# EAGLE design lithium_battery_manager_v12 (EAGLE 9.0.1)
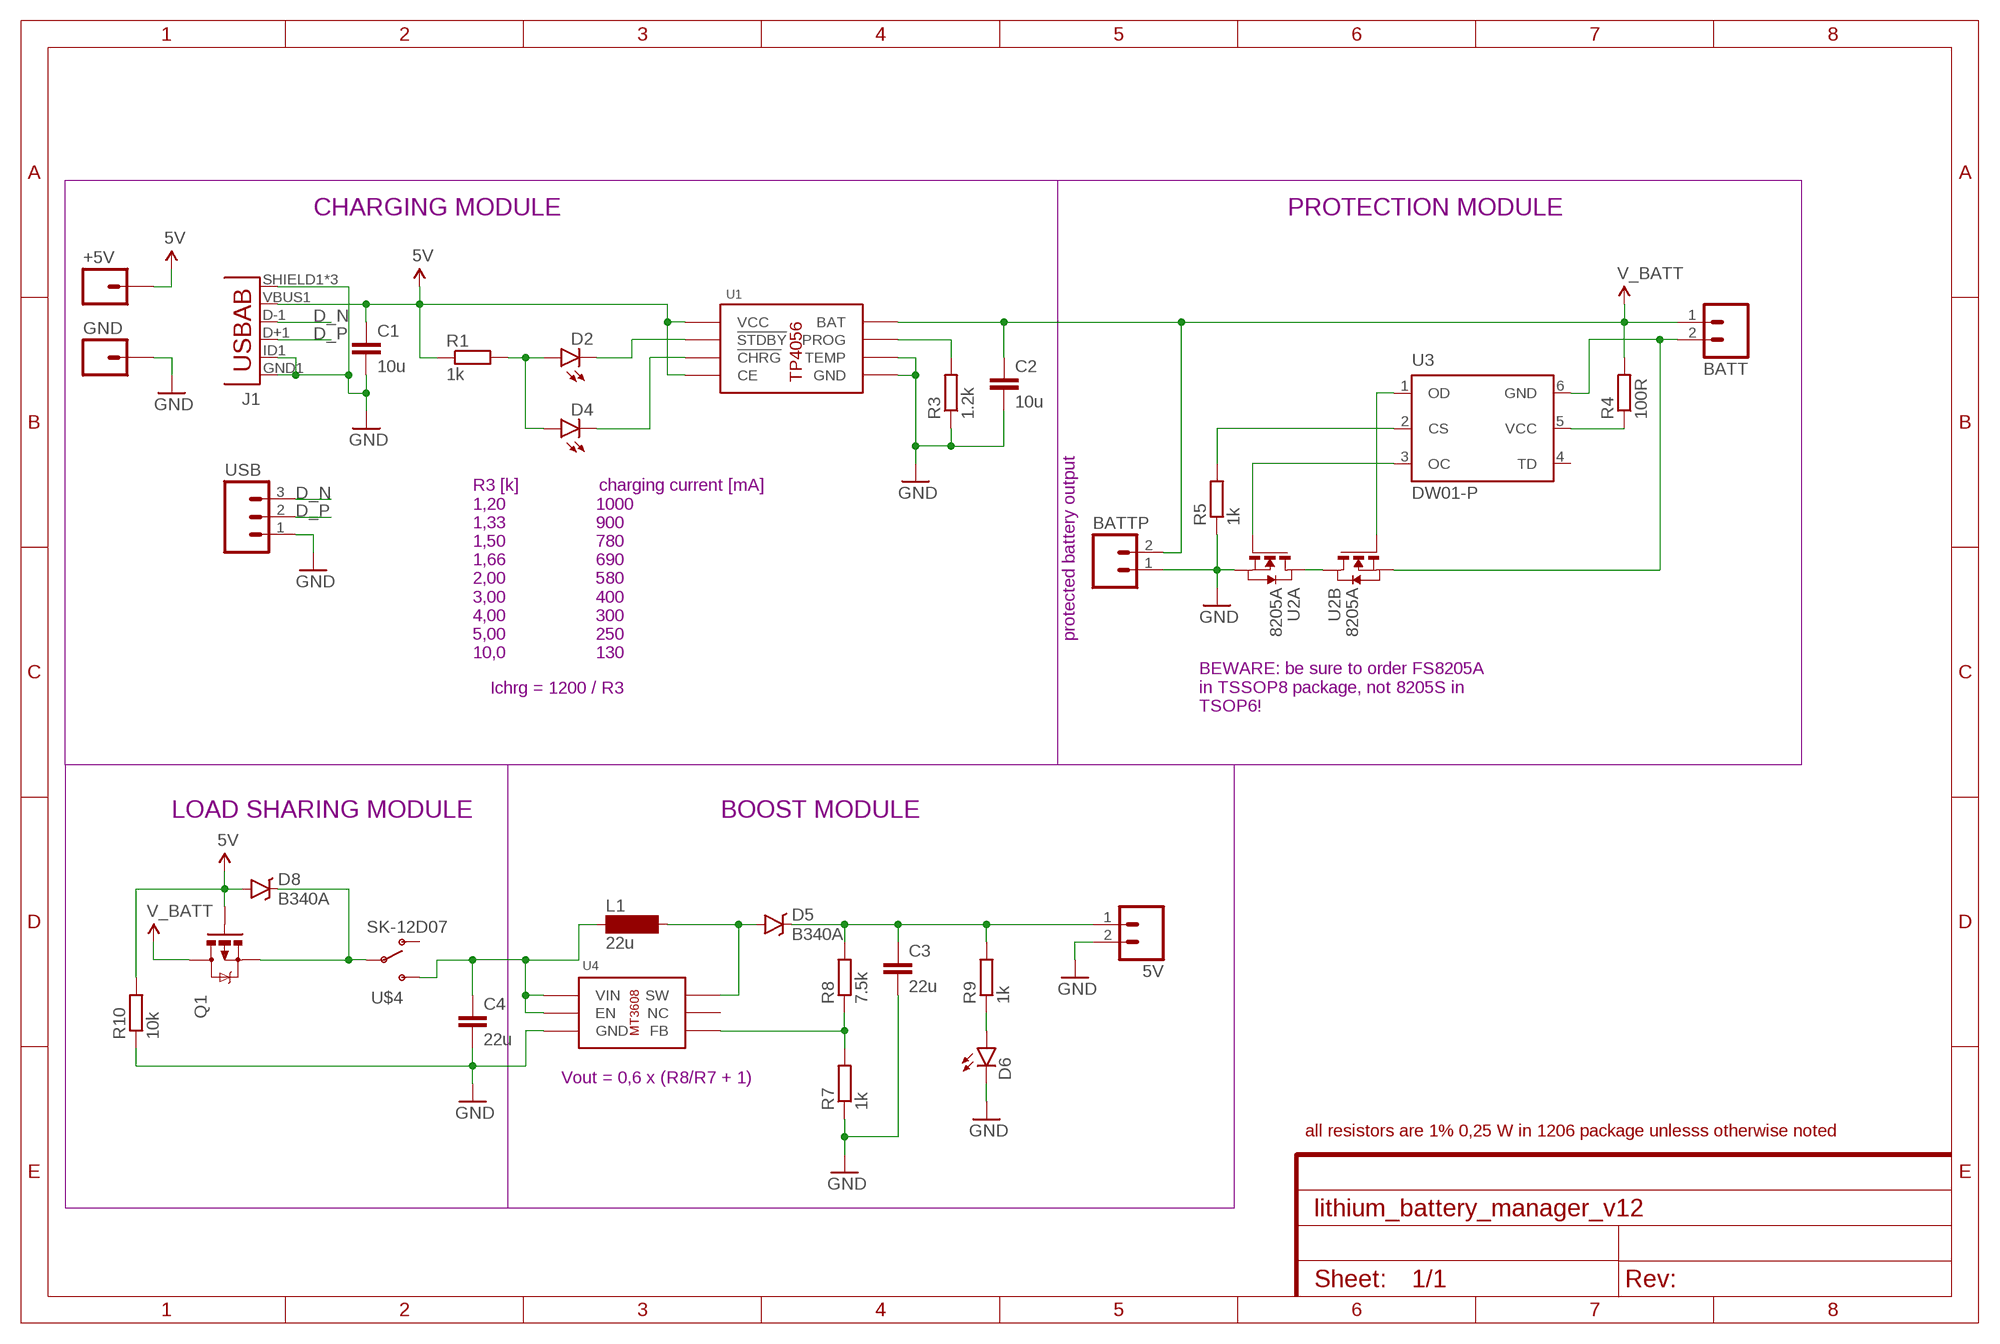
[diagram p0: schematic, sheet 1]
FRAME1 (FRAME-A4L): CNAME: Lithium Battery Utility Board; CREVISION: 1.3; DESIGNER: Martin DANEK, 2018

## Parts
5V  M02PTH3  [1X02_LONGPADS]
+5V  M01OFFSET  [1X01_OFFSET]
BATT  M02PTH3  [1X02_LONGPADS]
BATTP  M02PTH3  [1X02_LONGPADS]
C1  10u  C-EUC1206  [C1206]
C2  10u  C-EUC1206  [C1206]
C3  22u  C-EUC1206  [C1206]
C4  22u  C-EUC1206  [C1206]
D2  LED-CONN  [LED5MM]
D4  LED-CONN  [LED5MM]
D5  B340A  DIODE-SCHOTTKY-B340A  [SMA-DIODE]
D6  LED-CONN  [LED5MM]
D8  B340A  DIODE-SCHOTTKY-B340A  [SMA-DIODE]
GND  M01OFFSET  [1X01_OFFSET]
J1  USB-ABCONN-11794  [USB-AB-MICRO-SMD_V03]
L1  22u  MS85  [MS85]
Q1  MOSFET-PCHANNEL  [SOT23-3]
R1  1k  R-EU_R1206  [R1206]
R3  1.2k  R-EU_R1206  [R1206]
R4  100R  R-EU_R1206  [R1206]
R5  1k  R-EU_R1206  [R1206]
R7  1k  R-EU_R1206  [R1206]
R8  7.5k  R-EU_R1206  [R1206]
R9  1k  R-EU_R1206  [R1206]
R10  10k  R-EU_R1206  [R1206]
U1  TP4056  [SOP8]
U2  8205A  [TSSOP8]
U3  DW01-P  [SOT23-6L]
U4  MT3608  [SOT23-6]
U$4  SK-12D07  [SK12SWITCH]
USB  M03PTH  [1X03]

## Nets
5V: +5V.1 C1.1 D8.A J1.VBUS1(VBUS) Q1.1(G) R1.1 R10.2 U1.4(VCC) U1.8(CE)
D_N: J1.D-1(D-) USB.3
D_P: J1.D+1(D+) USB.2
GND: 5V.2 BATTP.1 C1.2 C2.2 C3.2 C4.2 D6.K(C) GND.1 J1.GND1(GND) J1.ID1(USBID) J1.SHIELD1(SHIELD) J1.SHIELD2(SHIELD) J1.SHIELD3(SHIELD) R3.1 R5.1 R7.1 R10.1 U1.1(TEMP) U1.3(GND) U2.2(A:S) U2.3(A:S) U4.2(GND) USB.1
N$1: C4.1 L1.1 U4.4(EN) U4.5(VIN) U$4.IN(S)
N$3: D2.K(C) U1.6(!STDBY)
N$4: D2.A D4.A R1.2
N$5: R3.2 U1.2(PROG)
N$6: R4.1 U3.5(VCC)
N$7: D4.K(C) U1.7(!CHRG)
N$8: BATT.2 U2.6(B:S) U2.7(B:S) U3.6(GND)
N$9: U2.1(A:D) U2.8(B:D)
N$10: U2.5(B:G) U3.1(OD)
N$11: U2.4(A:G) U3.3(OC)
N$12: D5.A L1.2 U4.1(SW)
N$13: R5.2 U3.2(CS)
N$14: R7.2 R8.1 U4.3(FB)
N$16: D6.A R9.1
N$17: D8.C Q1.2(S) U$4.P2(P)
N$20: 5V.1 C3.1 D5.C R8.2 R9.2
V_BATT: BATT.1 BATTP.2 C2.1 Q1.3(D) R4.2 U1.5(BAT)
Unconnected: U3.4(TD) U4.6(NC) U$4.P1(O)

## Notes on the sheet
- CHARGING MODULE | PROTECTION MODULE
- protected battery output
- R3 [k]                charging current [mA]
  1,20                  1000
  1,33                  900
  1,50                  780
  1,66                  690
  2,00                  580
  3,00                  400
  4,00                  300
  5,00                  250
  10,0                  130
- Ichrg = 1200 / R3
- BEWARE: be sure to order FS8205A
  in TSSOP8 package, not 8205S in 
  TSOP6!
- LOAD SHARING MODULE | BOOST MODULE
- Vout = 0,6 x (R8/R7 + 1)
- all resistors are 1% 0,25 W in 1206 package unlesss otherwise noted

## Library data of the parts
5V BATT BATTP = SparkFun-Connectors:M02: Standard 2-pin 0.1" header. Use with - straight break away headers ( PRT-00116) - right angle break away headers (PRT-00553) - swiss pins (PRT-00743) - machine pins (PRT-00117) - female headers (PRT-00115) Molex polarized connector foot print use with: PRT-08233 with associated crimp pins and housings. 2.54_SCREWTERM for use with PRT-10571. 3.5mm Screw Terminal footprints for PRT-08084 5mm Screw Terminal footprints for use with PRT-08432
+5V GND = SparkFun-Connectors:M01: Header 1 Standard 1-pin 0.1" header. Use with straight break away headers (SKU : PRT-00116), right angle break away headers (PRT-00553), swiss pins (PRT-00743), machine pins (PRT-00117), and female headers (PRT-00115). SMTSO-256-ET is a "flush mount" nut for a 4-40 screw. The older package used to be too tight, and did not allow it to sit properly thru the drill hit. The latest (0.165DIA) fits nice and snug.
C1-C4 = resistor:C-EU: CAPACITOR, European symbol
D2 D4 D6 = custom:LED-CONN
D5 D8 = SparkFun-DiscreteSemi:DIODE-SCHOTTKY: Schottky diodes in SFE's production catalog BAT20J 1A 23V 0.62Vf RB751 120mA 40V 0.37Vf PMEG4005EJ 0.5A 40V 0.42Vf MBRA140 1A 40V 0.5Vf B340A 3A 40V SMA; PROD_ID: DIO-09886
J1 = SparkFun-Connectors:USB-AB: This is a USB AB connector that is compatible with USB OTG. i.e. this connector can serve as a host or device; PROD_ID: CONN-11794
L1 = inductor-neosid:MS85: INDUCTOR SMD power inductor; OC_FARNELL: unknown; OC_NEWARK: unknown
Q1 = SparkFun-DiscreteSemi:MOSFET-PCHANNEL: Generic PMOSFET IRLML2244 - TRANS-11153 (SOT-23 -20V -4.3A) (1.Gate 2.Source 3.Drain) FQP27P06 - COM-10349 <http://www.sparkfun.com/products/10349> (TO-220 -60V -27A) (1.Gate 2.Source 3.Drain); PROD_ID: TRANS-08285
R1 R3-R5 R7-R10 = resistor:R-EU_: RESISTOR, European symbol
U1 = custom:TP4056
U2 = lipo:8205A: DUAL N-CHANNEL MOSFET The 8205A uses advanced trench technology to provide excellent RDS(ON), low gate charge and operation with gate voltages as low as 2.5V. This device is suitable for use as a Battery protection or in other Switching application.
U3 = lipo:DW01-P: One Cell Lithium-ion/Polymer Battery Protection IC The DW01-P battery protection IC is designed to protect lithium-ion/polymer battery from damage or degrading the lifetime due to overcharge, overdischarge, and/or overcurrent for one-cell lithium-ion/polymer battery powered systems, such as cellular phones. The ultra-small package and less required external components make it ideal to integrate the DW01-P into the limited space of battery pack. The accurate ±50mV overcharging detection voltage ensures safe and full utilization charging. The very low standby current drains little current from the cell while in storage.
U4 = custom:MT3608
U$4 = custom:SK-12D07
USB = SparkFun-Connectors:M03: Header 3 Standard 3-pin 0.1" header. Use with straight break away headers (SKU : PRT-00116), right angle break away headers (PRT-00553), swiss pins (PRT-00743), machine pins (PRT-00117), and female headers (PRT-00115). Molex polarized connector foot print use with SKU : PRT-08232 with associated crimp pins and housings.

## Board
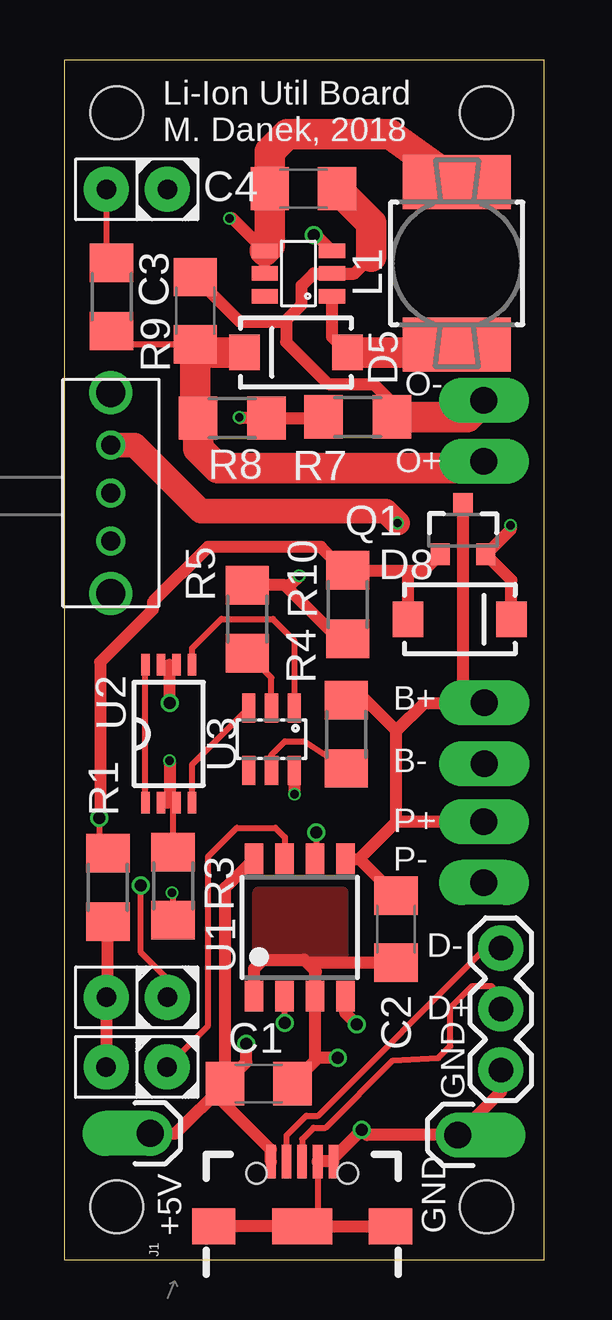
[diagram p1: board, top side]
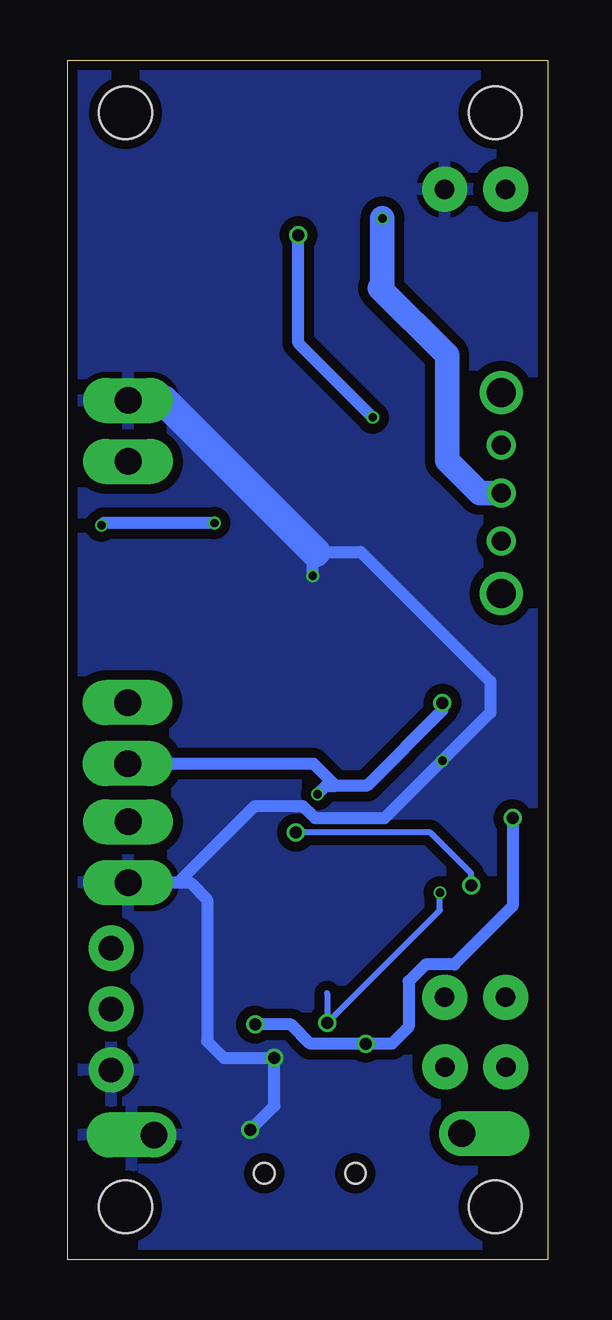
[diagram p2: board, bottom side, seen from below]

Size 20 x 50 mm. Coordinates in mm from the lower left corner, seen from the top.
Outline: 0,0 20,0 20,50 0,50 0,0
Copper layers (1*16): Top 0.035mm / dielectric 1.2mm / Bottom 0.035mm
Design rules "JLCPCB": minimum track width 5mil, minimum drill 0.3mm, track to track 5mil, track to pad 5mil, pad to pad 5mil, via to via 5mil, smd to smd 5mil, copper to edge 0.2mm, drill to drill 6mil, minimum pad ring 3mil, minimum via ring 3mil, stop-mask expansion 4mil, vias tented up to drill 0mil, thermal gap 10mil
Holes 2.2 mm at 2.2,2.2 17.6,2.2 2.2,47.8 17.6,47.8

### Footprints (pad centres in the part's own frame; a part is rotated, then mirrored left to right if it is on the bottom)
1X02_LONGPADS = drill 1.118 pad 1.88 long: 1 0,0; 2 2.54,0
1X01_OFFSET = drill 1.118 pad 1.88 offset: 1 0,0
C1206 = smd 1.6 x 1.8: 1 -1.4,0; 2 1.4,0
LED5MM = drill 0.813 pad 1.88: A -1.27,0; K 1.27,0
SMA-DIODE = smd 1.27 x 1.47: A -2.15,0; C 2.15,0
USB-AB-MICRO-SMD_V03 = smd 1.4 x 0.4: D+1 2.7,0; D-1 2.7,0.65; GND1 2.7,-1.3; ID1 2.7,-0.65; VBUS1 2.7,1.3 | smd 1.5 x 1.8: SHIELD1 0,3.68; SHIELD3 0,-3.68 | smd 1.5 x 2.5: SHIELD2 0,0 | hole 0.85: 2.2,1.9; 2.2,-1.9
MS85 = smd 4.5 x 2.25: 1 0,-3.383; 2 0,3.383
SOT23-3 = smd 0.8 x 0.9: 1 -0.95,-1; 2 0.95,-1; 3 0,1.1
R1206 = smd 1.6 x 1.803: 1 -1.422,0; 2 1.422,0
SOP8 = smd 0.76 x 1.27: 1 -1.905,-2.86; 2 -0.635,-2.86; 3 0.635,-2.86; 4 1.905,-2.86; 5 1.905,2.86; 6 0.635,2.86; 7 -0.635,2.86; 8 -1.905,2.86
TSSOP8 = smd 0.9 x 0.35: 1 -2.875,0.975; 2 -2.875,0.325; 3 -2.875,-0.325; 4 -2.875,-0.975; 5 2.875,-0.975; 6 2.875,-0.325; 7 2.875,0.325; 8 2.875,0.975
SOT23-6L = smd 0.55 x 1.2: 1 -0.95,-1.3; 2 0,-1.3; 3 0.95,-1.3; 4 0.95,1.3; 5 0,1.3; 6 -0.95,1.3
SOT23-6 = smd 0.6 x 1.1: 1 0,0; 2 0.95,0; 3 1.9,0; 4 1.9,2.8; 5 0.95,2.8; 6 0,2.8
SK12SWITCH = drill 0.8: IN 0,0; P1 0,2; P2 0,-2 | drill 1.2: PIN1 0,4.191; PIN2 0,-4.191
1X03 = drill 1.016 pad 1.88: 1 0,0; 2 2.54,0; 3 5.08,0

### Placement (x,y rotation side)
5V  17.49,33.27 90 top
+5V  3.59,5.26 90 top
BATT  17.51,23.21 270 top
BATTP  17.49,15.71 90 top
C1  8.11,7.33 0 top
C2  13.83,13.77 270 top
C3  5.47,39.55 90 top
C4  9.97,44.63 0 top
D2  3.03,10.93 0 top
D4  3.02,8.03 0 top
D5  9.66,37.81 180 top
D6  3.03,44.61 0 top
D8  16.49,26.69 0 top
GND  16.41,5.19 270 top
J1  9.92,1.39 90 top
L1  16.37,41.52 180 top
Q1  16.62,30.39 0 top
R1  1.83,15.51 270 top
R3  4.54,15.56 270 top
R4  11.76,21.89 90 top
R5  7.63,26.69 270 top
R7  12.24,35.12 180 top
R8  7.01,35.07 180 top
R9  1.98,40.12 270 top
R10  11.82,27.3 90 top
U1  9.82,13.84 0 top
U2  4.36,21.91 90 top
U3  8.64,21.69 180 top
U4  11.16,40.15 90 top
U$4  1.95,31.95 180 top
USB  18.2,7.9 90 top

### Tracks (layer width: path | path; a pad name or v marks a point on that pad's centre or on a via)
5V  (via drill 0.5)
  Top 0.254: v1.47,18.4 1.47,17.29 R1.1
  Top 0.508: +5V.1 4.64,5.26 C1.1 | J1.VBUS1 8.62,4.58 6.6,6.6 6.6,7.22 C1.1 | U1.8 6.71,15.49 C1.1 | C1.1 7.6,8.22 v7.6,9 | v12.2,9.8 11.72,10.28 U1.4 | 14.2,28.72 R10.2 11.68,28.72 10.7,29.7 6,29.7 3.7,27.4 3.7,27.1 1.5,24.9 1.5,18.43 v1.47,18.4 | 14.2,28.72 15,28.72 Q1.1 | D8.A 14.34,28.58 14.2,28.72
  Bottom 0.508: v12.2,9.8 10.7,9.8 9.9,9 v7.6,9 6.5,9 5.8,9.7 5.8,11.6 5.1,12.3 3.9,12.3 1.47,14.73 v1.47,18.4
D_N
  Top 0.254: J1.D-1 9.27,5.17 10.1,6 10.6,6 17.58,12.98 USB.3
D_P
  Top 0.254: J1.D+1 9.92,5.02 10.4,5.5 10.9,5.5 13.7,8.3 15.6,8.4 16.1,8.9 16.1,10.5 17,11.4 17.8,11.4 18.2,10.9 USB.2
GND  (via drill 0.35, 0.5)
  Top 0.254: J1.ID1 10.57,1.46 10.5,1.39 | U2.2 4.3,19.04 U2.3 | R3.1 4.54,19 4.4,19.14
  Top 0.508: 12.8,41.8 12.1,41.1 U4.2 10.4,41.1 9.9,40.6 9.9,39.8 9.25,39.15 | 9.25,39.15 9.2,39.1 7.32,39.1 C3.2 | J1.SHIELD1 J1.SHIELD2 10.5,1.39 J1.SHIELD3 | U1.1 7.92,12.12 8.3,12.5 10,12.5 10.13,12.37 | 10.13,12.37 10.5,12 10.46,11.96 U1.3 10.46,8.28 | 10.46,8.28 C1.2 | C2.2 10.13,12.37 | USB.1 18.2,6.98 GND.1 12.62,5.19 12.52,5.29 v12.4,5.4 11.22,4.22 J1.GND1 J1.ID1 | v11.4,8.4 10.58,8.4 10.46,8.28 | 9.25,39.15 9.25,38.25 11,36.5 12.9,36.5 13.7,35.7 13.66,35.66 R7.1 | R10.1 11.42,25.88 9.19,28.11 | 9.19,28.11 R5.1 | v4.4,20.8 4.4,19.14 4.3,19.04 | 9.19,28.11 9.41,28.11 v9.8,28.5
  Top 1.27: C4.2 12.8,43.2 12.8,41.8 | 5V.2 16.8,35.12 R7.1
  Bottom 0.508: v12.4,5.4 11.4,6.4 v11.4,8.4 13.5,8.4 14.2,9.1 14.2,15 14.91,15.71 15.4,15.71 | BATTP.1 15.4,15.71 | 15.4,15.71 12.21,18.9 10.21,18.9 9.93,18.61 9.91,18.61 9.7,18.4 6.8,18.4 v4.4,20.8 2.4,22.8 2.4,24.1 7.8,29.5 9.7,29.5 9.8,29.4 v9.8,28.5
  Bottom 1.27: 5V.2 16.01,35.81 9.7,29.5
  pour Top: 8.1,15.3 11.6,15.3 11.6,12.5 8.1,12.5
  pour Bottom (isolate 0.406): 0,50 20,50 20,0.1 0,0.1
N$1  (via drill 0.35)
  Top 0.508: U4.5 U4.4 7.01,43.4 v6.9,43.4
  Top 1.27: L1.1 13.57,46.9 9.3,46.9 8.57,46.17 C4.1 8.57,42.26 U4.4
  Bottom 1.016: U$4.IN 2.85,31.95 4.2,33.3 4.2,37.7 7,40.5 6.9,40.6 v6.9,43.4
N$3  (via drill 0.5)
  Top 0.254: U1.6 10.5,16.75 v10.5,17.8 | D2.K 4.3,11.7 3.2,12.8 v3.2,15.6
  Bottom 0.254: v3.2,15.6 3.2,16.1 4.9,17.8 v10.5,17.8
N$4
  Top 0.508: D4.A D2.A 1.83,11 R1.2
N$5  (via drill 0.35, 0.5)
  Top 0.254: v9.2,9.86 9.19,9.88 U1.2 | v4.5,15.3 4.6,14.08 R3.2
  Bottom 0.254: 9.2,11.1 v9.2,9.86 6.23,12.83 6.16,12.9 4.5,14.56 v4.5,15.3
N$6
  Top 0.254: U3.5 8.64,21.04 9.2,21.6 10.03,21.6 R4.1
N$7
  Top 0.254: D4.K 6,9.74 6,16.8 7.2,18 8.8,18 9.2,17.6 9.19,17.59 U1.7
N$8  (via drill 0.35, 0.5)
  Top 0.254: U2.7 4.4,24.79 U2.6
  Top 0.508: v4.4,23.2 4.4,24.79 | U3.6 v9.59,19.41 v9.6,19.4
  Bottom 0.508: v4.4,23.2 4.4,22.9 7.55,19.75 8.85,19.75 | 8.85,19.75 9.77,20.67 BATT.2 | v9.6,19.4 9.25,19.75 8.85,19.75
N$9
  Top 0.254: U2.1 U2.8
N$10
  Top 0.254: U3.1 9.59,25.81 8.7,26.7 6.55,26.7 5.33,25.48 U2.5
N$11
  Top 0.254: U2.4 5.33,19.8 5.33,19.93 5.33,20.64 U3.3
N$12
  Top 0.508: U4.1 11.16,38.46 D5.A
  Top 1.27: D5.A 16.04,37.81 L1.2
N$13
  Top 0.254: U3.2 8.64,24.26 R5.2
N$14  (via drill 0.35, 0.5)
  Top 0.508: U4.3 10.51,42.7 v10.4,42.7 | R7.2 10.77,35.07 R8.1 7.33,35.07 v7.3,35.1
  Bottom 0.508: v7.3,35.1 10.4,38.2 v10.4,42.7
N$16
  Top 0.254: D6.A 1.76,41.76 R9.1
N$17  (via drill 0.35)
  Top 0.508: D8.C 18.64,28.32 Q1.2 18.61,30.43 v18.61,30.6
  Top 1.016: v13.9,30.7 13.4,31.2 5.7,31.2 2.95,33.95 U$4.P2
  Bottom 0.508: v13.9,30.7 18.51,30.7 v18.61,30.6
N$20
  Top 0.254: R9.2 2.53,38.15 C3.1
  Top 1.27: D5.C 5.81,37.81 C3.1 5.47,35.19 R8.2 5.59,33.81 6.4,33 17.22,33 5V.1
V_BATT
  Top 0.508: U1.5 12.3,16.7 | 12.3,16.7 C2.1 | BATTP.2 13.85,18.25 | 13.85,18.25 12.3,16.7 | 13.85,18.25 13.85,22.05 | 13.85,22.05 15,23.2 16.5,23.2 | 16.5,23.2 BATT.1 | R4.2 12.59,23.31 13.85,22.05 | Q1.3 16.62,23.32 16.5,23.2

### Text on the board
tNames: Li-Ion Util Board / M. Danek, 2018 | O- | O+ | B+ | B- | P+ | P- | D- | D+ | GND | +5V | GND